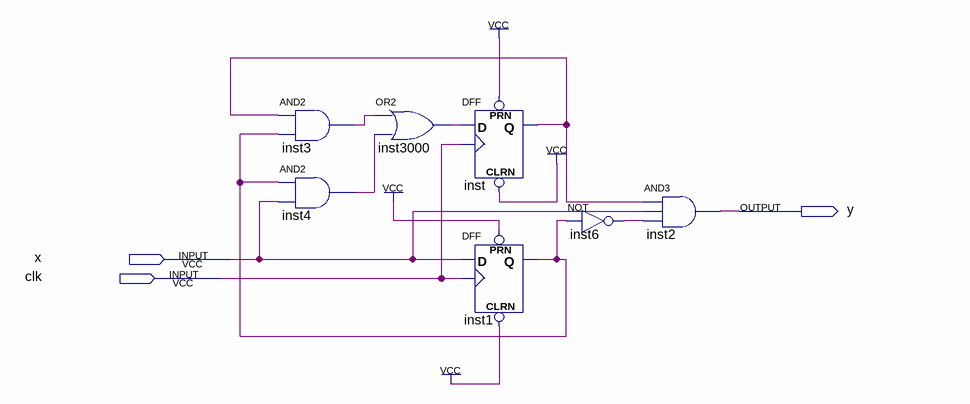
[diagram p0: schematic sheet]
// Quartus schematic SeqDet110.bdf as structural Verilog: 7 symbols, 3 pins
module SeqDet110 (
  input  x,
  input  clk,
  output y
);

  wire inst1_q, inst3_out, inst4_out, inst6_out, inst3000_out, inst_q;

  and inst3 (inst3_out, inst_q, inst1_q);
  and inst4 (inst4_out, inst1_q, x);
  or inst3000 (inst3000_out, inst3_out, inst4_out);
  DFF inst (.CLRN(1'b1), .CLK(clk), .D(inst3000_out), .PRN(1'b1), .Q(inst_q));
  DFF inst1 (.CLRN(1'b1), .CLK(clk), .D(x), .PRN(1'b1), .Q(inst1_q));
  not inst6 (inst6_out, inst1_q);
  and inst2 (y, inst_q, x, inst6_out);
endmodule
